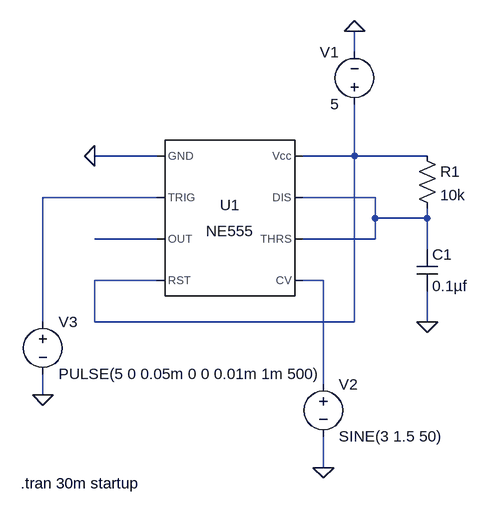
[diagram p0: schematic NE555_PWM_Debugging.asc]
NE555_PWM_Debugging.asc, the LTspice schematic file:
Version 4
SHEET 1 880 680
WIRE 400 -80 400 -112
WIRE 96 80 0 80
WIRE 400 80 400 0
WIRE 400 80 320 80
WIRE 512 80 400 80
WIRE 96 144 -80 144
WIRE 432 144 320 144
WIRE 432 176 432 144
WIRE 512 176 512 160
WIRE 512 176 432 176
WIRE 96 208 0 208
WIRE 432 208 432 176
WIRE 432 208 320 208
WIRE 512 224 512 176
WIRE 96 272 0 272
WIRE 352 272 320 272
WIRE -80 336 -80 144
WIRE 0 336 0 272
WIRE 400 336 400 80
WIRE 400 336 0 336
WIRE 512 336 512 288
WIRE 352 432 352 272
WIRE -80 448 -80 416
WIRE 352 560 352 512
FLAG 0 80 0
FLAG 400 -112 0
FLAG 352 560 0
FLAG 512 336 0
FLAG -80 448 0
SYMBOL Misc\\NE555 208 176 R0
SYMATTR InstName U1
SYMBOL voltage 400 16 R180
WINDOW 0 24 96 Left 2
WINDOW 3 24 16 Left 2
SYMATTR InstName V1
SYMATTR Value 5
SYMBOL voltage 352 416 R0
WINDOW 123 0 0 Left 0
WINDOW 39 0 0 Left 0
SYMATTR InstName V2
SYMATTR Value SINE(3 1.5 50)
SYMBOL cap 496 224 R0
SYMATTR InstName C1
SYMATTR Value 0.1µf
SYMBOL res 496 64 R0
SYMATTR InstName R1
SYMATTR Value 10k
SYMBOL voltage -80 320 R0
WINDOW 123 0 0 Left 0
WINDOW 39 0 0 Left 0
SYMATTR InstName V3
SYMATTR Value PULSE(5 0 0.05m 0 0 0.01m 1m 500)
TEXT -114 584 Left 2 !.tran 30m startup

The netlist it stands for:
* NE555_PWM_Debugging.asc
XU1 0 N002 N004 N001 N005 N003 N003 N001 NE555  ; pins GND TRIG OUT RST CV THRS DIS Vcc
V1 N001 0 5
V2 N005 0 SINE(3 1.5 50)
C1 N003 0 0.1µf
R1 N001 N003 10k
V3 N002 0 PULSE(5 0 0.05m 0 0 0.01m 1m 500)
.tran 30m startup
.lib NE555.sub
.backanno
.end